# EasyEDA schematic SCH_IntegratedAvionics Mk. 1_2024-03-19.json

## Sheets
1 Sheet_1SEN: TITLE: Sheet_1; REV: 1.0; Date: 2023-04-23; Sheet: 1/2; Drawn By: Finn Wolff; Company: WOLFF INDUSTRIES
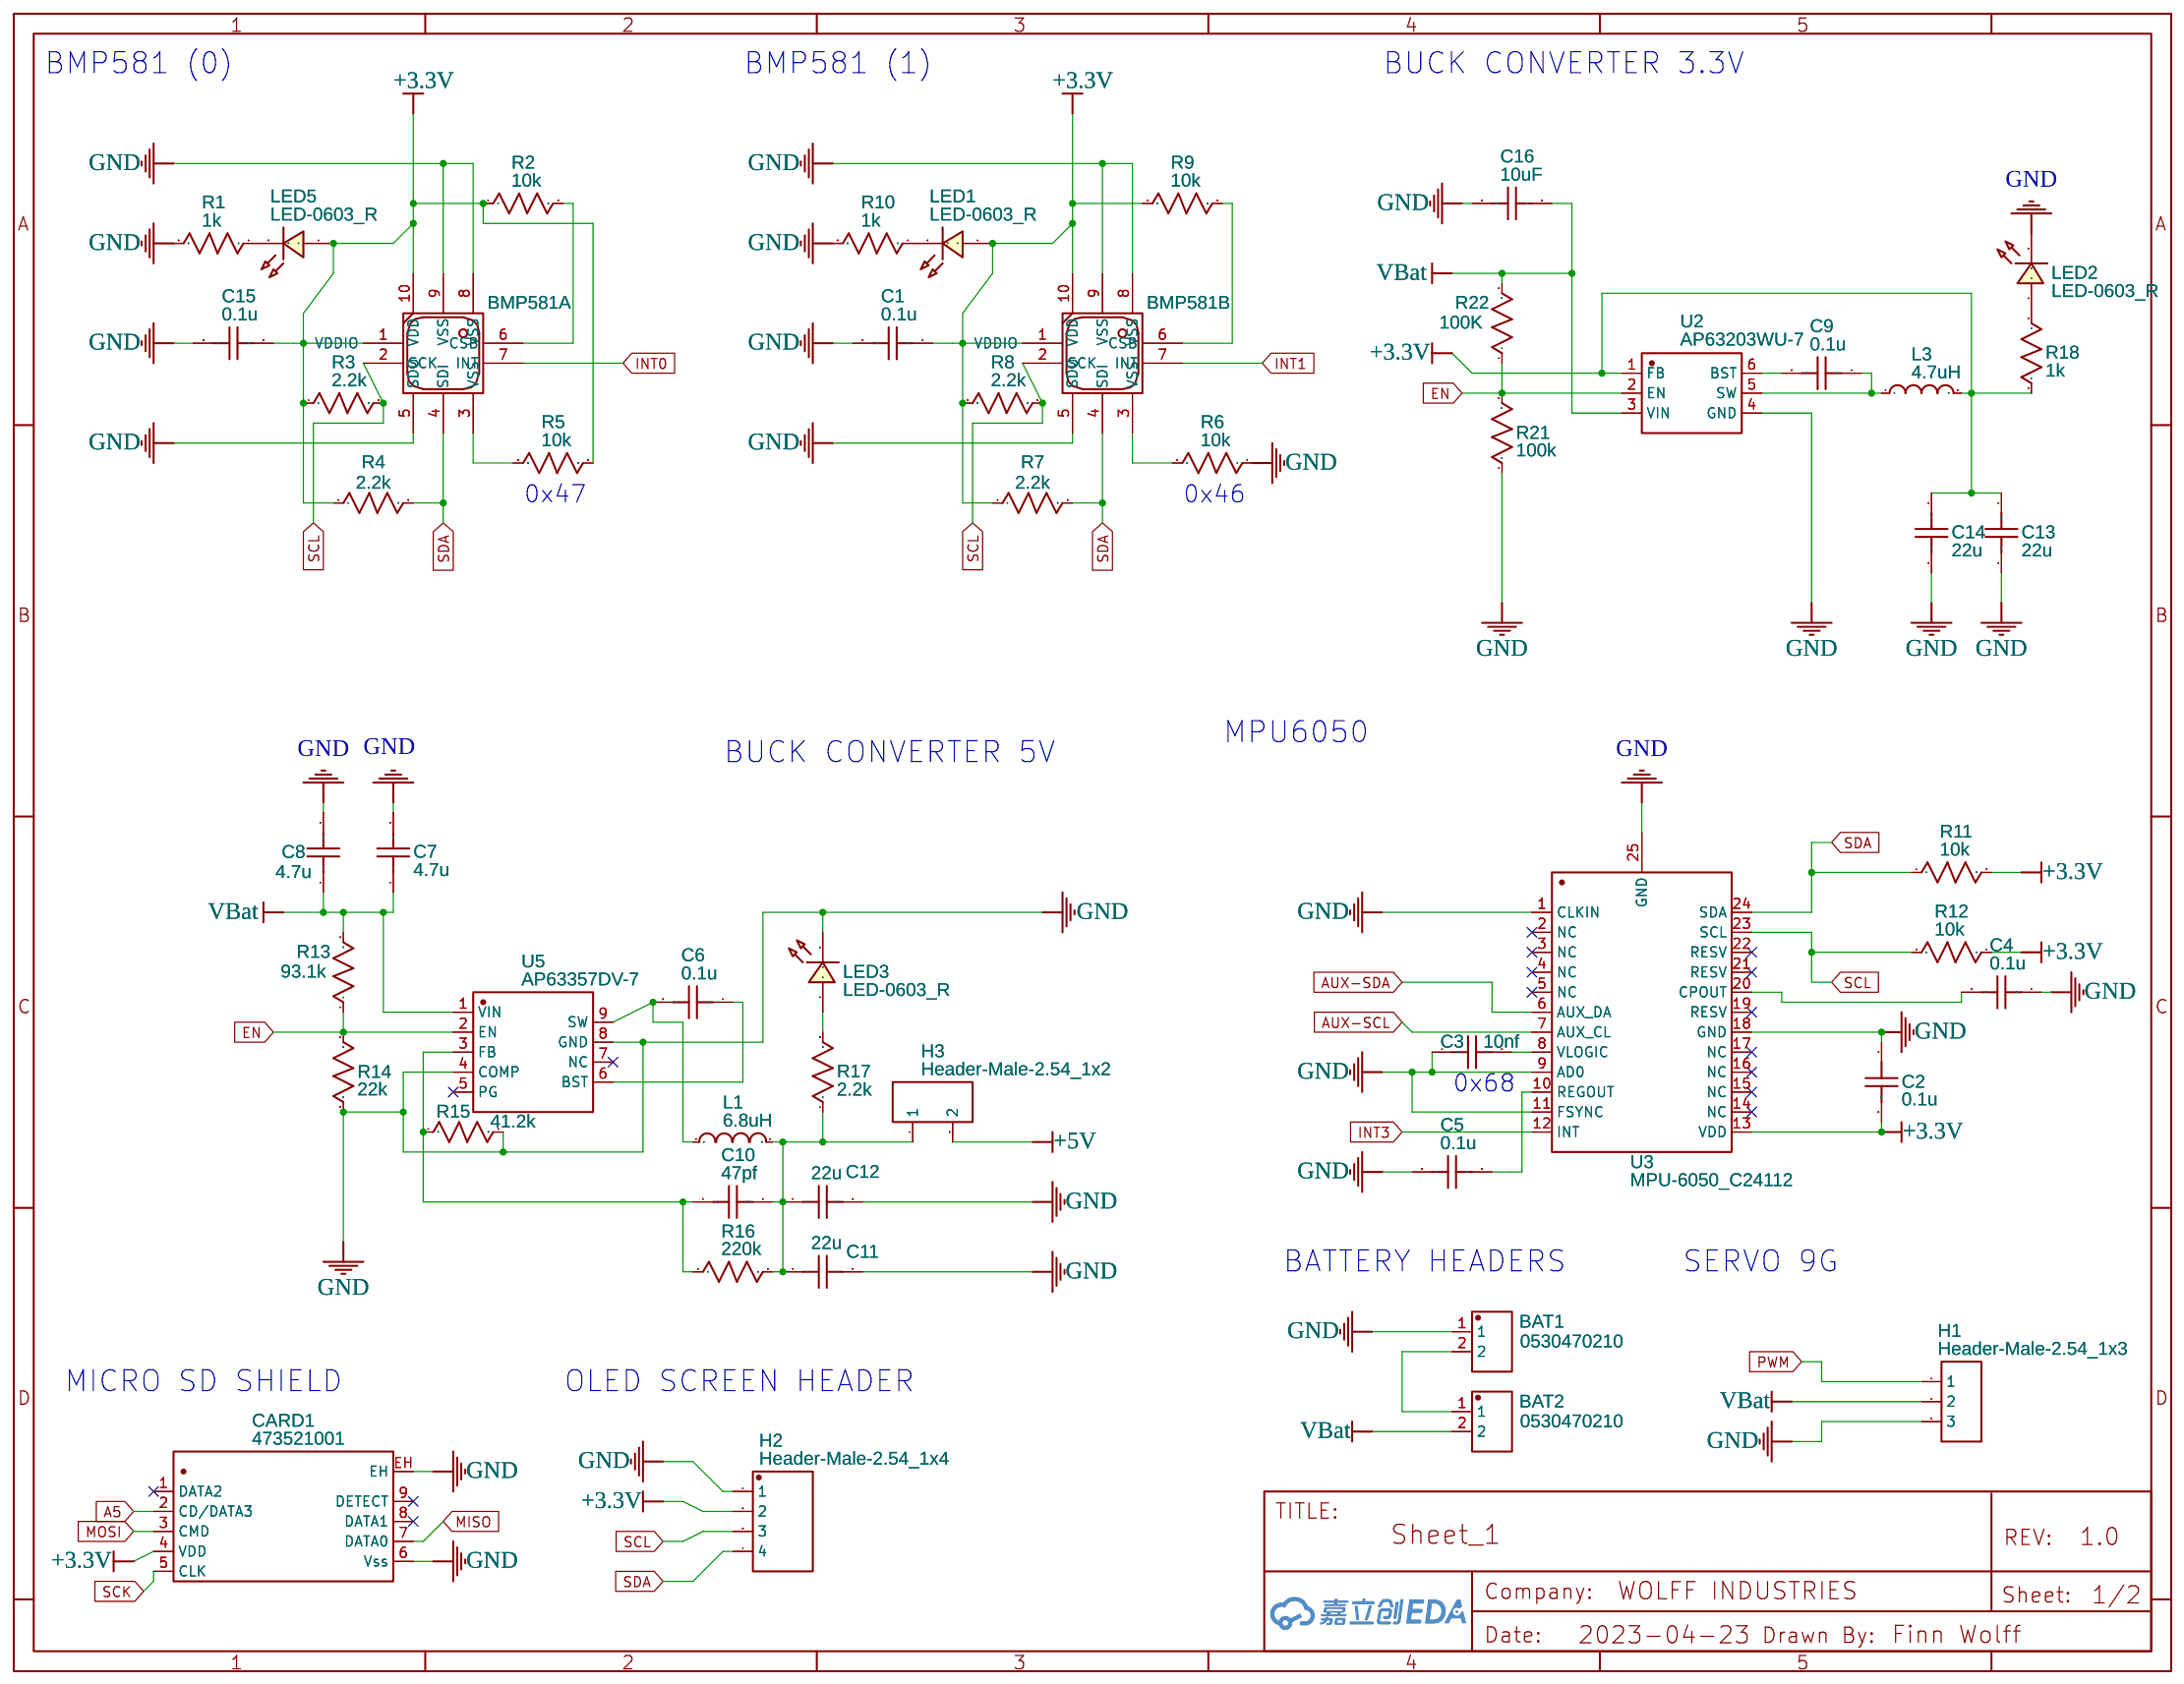
[diagram p0: Sheet_1SEN]
2 Sheet_2ESP: TITLE: Sheet_2; Date: 2023-05-04; Sheet: 2/2; Company: Your Company
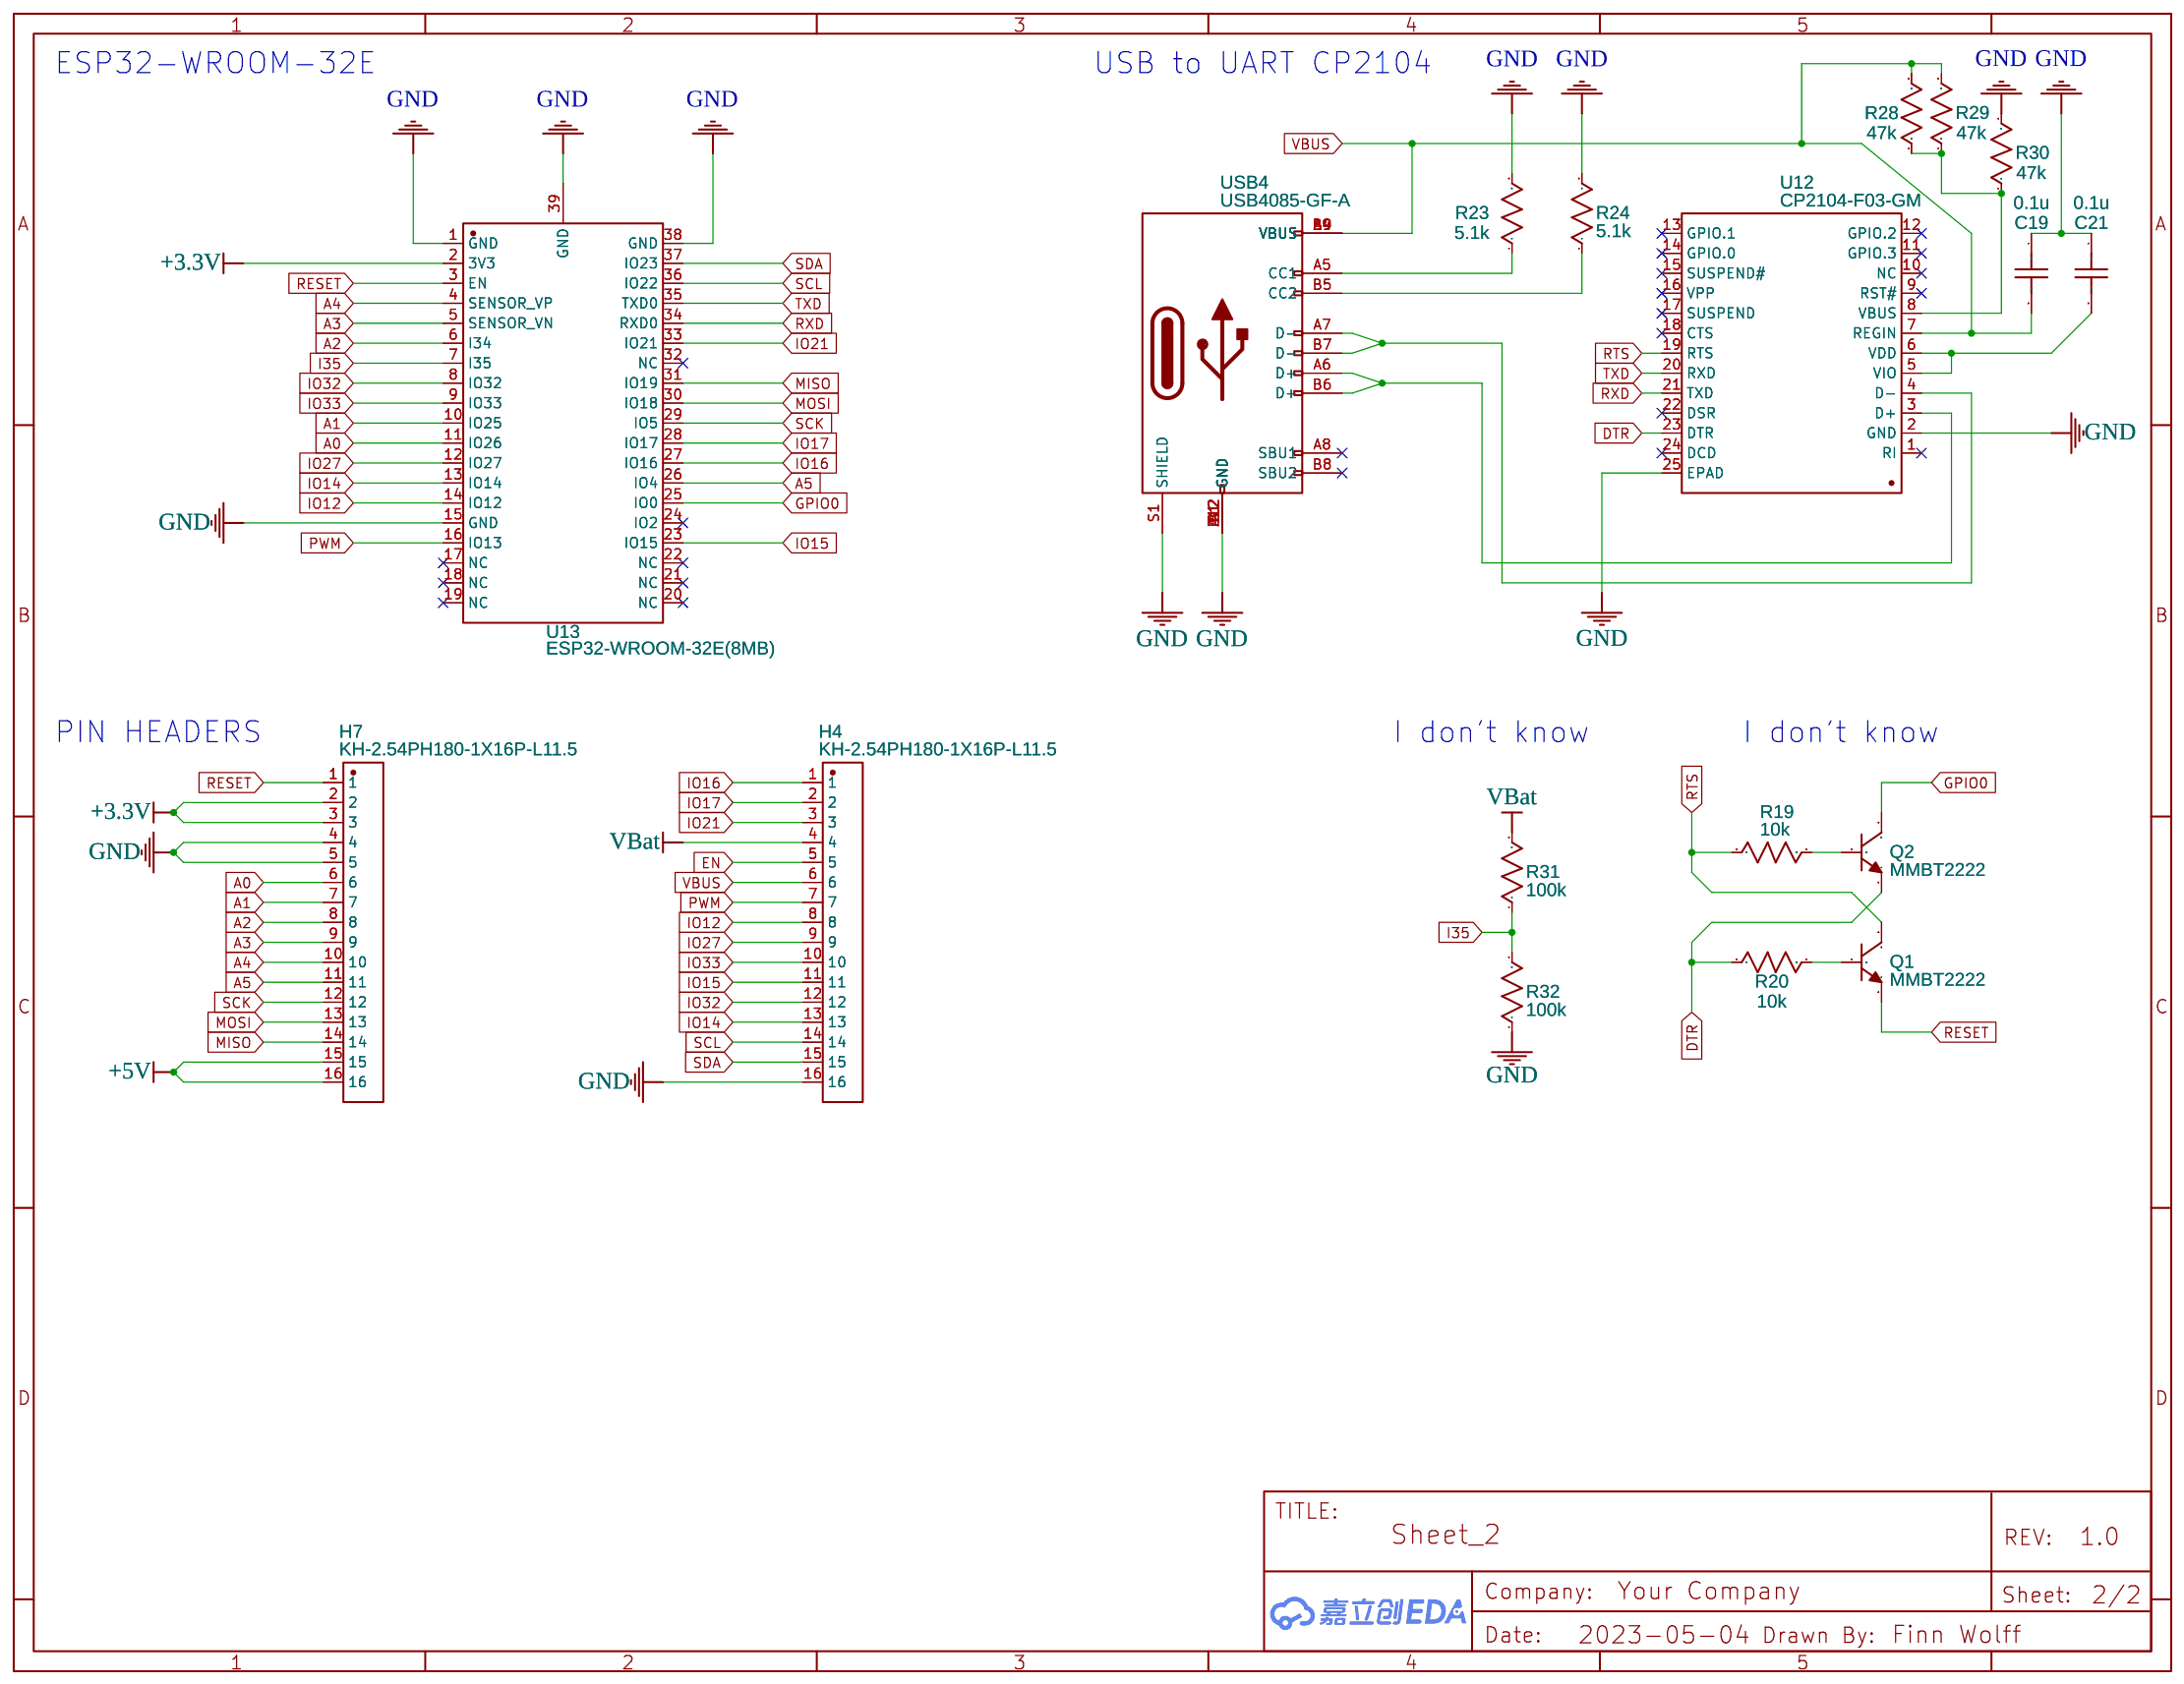
[diagram p1: Sheet_2ESP]

## Parts
sheet Sheet_1SEN
BAT1  0530470210  [CONN-TH_0530470210]
BAT2  0530470210  [CONN-TH_0530470210]
C1  0.1u  [C0402]
C2  0.1u  [C0402]
C3  10nf  [C0603]
C4  0.1u  [C0402]
C5  0.1u  [C0402]
C6  0.1u  [C0402]
C7  4.7u  [C0603]
C8  4.7u  [C0603]
C9  0.1u  [C0402]
C10  47pf  [C0603]
C11  22u  [C0603]
C12  22u  [C0603]
C13  22u  [C0603]
C14  22u  [C0603]
C15  0.1u  [C0402]
C16  10uF  [C1210]
CARD1  473521001  [SD-SMD_SD-47352-101]
H1  Header-Male-2.54_1x3  [HDR-TH_3P-P2.54-V-M-1]
H2  Header-Male-2.54_1x4  [HDR-TH_4P-P2.54-V-M]
H3  Header-Male-2.54_1x2  [HDR-TH_2P-P2.54-V-M-1]
L1  6.8uH  [IND-SMD_L5.0-W5.0_VLS5045EX-6R8M]
L3  4.7uH  [IND-SMD_L4.9-W4.9_NRS50XX]
LED1  LED-0603_R  [LED0603_RED]
LED2  LED-0603_R  [LED0603_RED]
LED3  LED-0603_R  [LED0603_RED]
LED5  LED-0603_R  [LED0603_RED]
R1  1k  [R0603]
R2  10k  [R0603]
R3  2.2k  [R0603]
R4  2.2k  [R0603]
R5  10k  [R0603]
R6  10k  [R0603]
R7  2.2k  [R0603]
R8  2.2k  [R0603]
R9  10k  [R0603]
R10  1k  [R0603]
R11  10k  [R0603]
R12  10k  [R0603]
R13  93.1k  [R0603]
R14  22k  [R0603]
R15  41.2k  [R0603]
R16  220k  [R0603]
R17  2.2k  [R0603]
R18  1k  [R0603]
R21  100k  [R0603]
R22  100K  [R0603]
U1  BMP581A  [BMP581]
U2  AP63203WU-7  [TSOT-26_L2.9-W1.6-P0.95-LS2.8-BL]
U3  MPU-6050_C24112  [QFN-24_L4.0-W4.0-P0.50-BL-EP2.7]
U4  BMP581B  [BMP581]
U5  AP63357DV-7  [V-DFN3020-13-A_L3.0-W2.0-P0.45-BL-EP_AP6335X]
sheet Sheet_2ESP
C19  0.1u  [C0603]
C21  0.1u  [C0603]
H4  KH-2.54PH180-1X16P-L11.5  [HDR-TH_16P-P2.54-V-M]
H7  KH-2.54PH180-1X16P-L11.5  [HDR-TH_16P-P2.54-V-M]
Q1  MMBT2222  [SOT-23-3_L2.9-W1.4-P1.91-LS2.6-BR]
Q2  MMBT2222  [SOT-23-3_L2.9-W1.4-P1.91-LS2.6-BR]
R19  10k  [R0603]
R20  10k  [R0603]
R23  5.1k  [R0603]
R24  5.1k  [R0603]
R28  47k  [R0603]
R29  47k  [R0603]
R30  47k  [R0603]
R31  100k  [R0603]
R32  100k  [R0603]
U12  CP2104-F03-GM  [QFN-24_L4.0-W4.0-P0.50-BL-EP2.7]
U13  ESP32-WROOM-32E(8MB)  [WIFI-SMD_ESP32-WROOM-32E]
USB4  USB4085-GF-A  [USC-C-SMD_USB4085-GF-A]

## Library data of the parts
BAT1 BAT2 = 0530470210: Supplier: LCSC; Manufacturer: MOLEX; Contributor: LCSC; Supplier Part: C114130; JLCPCB Part Class: Extended Part
C1 C2 C4-C6 C9 C15 = 0402B104K160CT: Contributor: LCSC; Supplier: LCSC; Supplier Part: C301929; Manufacturer: null; JLCPCB Part Class: Extended Part
C3 C7 C8 C10-C14 C19 C21 = C_0603_US: Contributor: LCEDA_Lib
C16 = CL32A106KA9LNNE: Contributor: LCSC; Supplier: LCSC; Supplier Part: C318783; Manufacturer: SAMSUNG(三星); JLCPCB Part Class: Extended Part
CARD1 = 473521001: Supplier: LCSC; Supplier Part: C293569; Manufacturer: MOLEX; Contributor: LCSC; JLCPCB Part Class: Extended Part
H1 = Header-Male-2.54_1x3: Supplier: LCSC; Manufacturer: BOOMELE(博穆精密); Manufacturer Part: 2.54-1*3P针; Supplier Part: C49257; JLCPCB Part Class: Extended Part
H2 = Header-Male-2.54_1x4: Supplier: LCSC; Manufacturer: Ckmtw(灿科盟); Manufacturer Part: B-2100S04P-A110; Contributor: LCSC; Supplier Part: C124378; JLCPCB Part Class: Extended Part
H3 = Header-Male-2.54_1x2: Supplier: LCSC; Manufacturer: TE Connectivity(美国泰科); Manufacturer Part: 826629-2; Supplier Part: C86471; JLCPCB Part Class: Extended Part
L1 = HPC5040NF-6R8M: Contributor: LCSC; Supplier: LCSC; Supplier Part: C357072; Manufacturer: TAI-TECH(台庆); JLCPCB Part Class: Extended Part
L3 = NRS5020T4R7MMGJ: Contributor: lcsc; Supplier: LCSC; Supplier Part: C92964; Manufacturer: TAIYO YUDEN(太诱); JLCPCB Part Class: Extended Part
LED1-LED3 LED5 = LED-0603_R: Manufacturer: EVERLIGHT(台湾亿光); Manufacturer Part: 19-217/R6C-AL1M2VY/3T; Supplier Part: C72044; Supplier: LCSC; Contributor: LCEDA_01
R1-R24 R28-R32 = R_0603_US: Contributor: LCEDA_Lib
U1 U4 = BMP581: Manufacturer: Bosch; Supplier: Digi-Key; Supplier Part: BMP581CT-ND; link: https://www.bosch-sensortec.com/products/environmental-sensors/pressure-sensors/bmp581/; Contributor: seradhe
U2 = AP63203WU-7: Contributor: LCSC; Supplier: LCSC; Supplier Part: C780769; Manufacturer: DIODES(美台); JLCPCB Part Class: Extended Part
U3 = MPU-6050_C24112: sourceId: 1T5FDZYC8; Supplier: LCSC; Manufacturer: TDK InvenSense(应美盛); Manufacturer Part: MPU-6050; Supplier Part: C24112; JLCPCB Part Class: Basic Part
U5 = AP63357DV-7: Supplier: LCSC; Supplier Part: C2158014; Manufacturer: DIODES(美台); Contributor: LCSC; JLCPCB Part Class: Extended Part
H4 H7 = KH-2.54PH180-1X16P-L11.5: Contributor: LCSC; Supplier: LCSC; Supplier Part: C2905491; Manufacturer: kinghelm(金航标); JLCPCB Part Class: Extended Part
Q1 Q2 = MMBT2222: Contributor: LCSC; Supplier: LCSC; Supplier Part: C2891810; Manufacturer: YONGYUTAI(永裕泰); JLCPCB Part Class: Extended Part
U12 = CP2104-F03-GM: Supplier: LCSC; Manufacturer: SILICON LABS(芯科); Manufacturer Part: CP2104-F03-GMR; Supplier Part: C47742; JLCPCB Part Class: Extended Part
U13 = ESP32-WROOM-32E(8MB): Supplier: LCSC; Supplier Part: C701342; Manufacturer: ESPRESSIF(乐鑫); Manufacturer Part: ESP32-WROOM-32E-N8; Contributor: LCSC; JLCPCB Part Class: Extended Part
USB4 = USB4085-GF-A: Supplier: LCSC; Supplier Part: C9900013983; Manufacturer: null; JLCPCB Part Class: Extended Part; Contributor: lcsc

## Nets
+3.3V: C1.1 C2.2 C13.1 C14.1 C15.1 CARD1.4(VDD) H2.2 H7.2 H7.3 L3.2 LED1.1 LED5.1 R2.1 R3.1 R4.1 R5.1 R7.1 R8.1 R9.1 R11.2 R12.1 R18.1 U1.10(VDD) U2.1(FB) U3.13(VDD) U4.10(VDD) U13.2(3V3)
+5V: H3.2 H7.15 H7.16
GND: BAT1.1 C1.2 C2.1 C3.1 C4.1 C5.2 C7.2 C8.2 C11.2 C12.2 C13.2 C14.2 C15.2 C16.2 C19.1 C21.1 CARD1.6(Vss) CARD1.EH H1.3 H2.1 H4.16 H7.4 H7.5 LED2.2 LED3.2 R1.2 R6.1 R10.2 R14.1 R15.2 R21.1 R23.2 R24.2 R30.2 R32.1 U1.5(SDO) U1.8(VSS) U1.9(VSS) U2.4(GND) U3.1(CLKIN) U3.9(AD0) U3.11(FSYNC) U3.18(GND) U3.25(GND) U4.5(SDO) U4.8(VSS) U4.9(VSS) U5.4(COMP) U5.8(GND) U12.2(GND) U12.25(EPAD) U13.1(GND) U13.15(GND) U13.38(GND) U13.39(GND) USB4.A1(GND) USB4.A12(GND) USB4.B1(GND) USB4.B12(GND) USB4.S1(SHIELD)
VBat: BAT2.2 C7.1 C8.1 C16.1 H1.2 H4.4 R13.2 R22.2 R31.2 U2.3(VIN) U5.1(VIN)
VBUS: C19.2 H4.6 R28.2 R29.2 U12.7(REGIN) USB4.A4(VBUS) USB4.A9(VBUS) USB4.B4(VBUS) USB4.B9(VBUS)
A0: H7.6 U13.11(IO26)
A1: H7.7 U13.10(IO25)
A2: H7.8 U13.6(I34)
A3: H7.9 U13.5(SENSOR_VN)
A4: H7.10 U13.4(SENSOR_VP)
A5: CARD1.2(CD/DATA3) H7.11 U13.26(IO4)
AUX-SCL: U3.7(AUX_CL)
AUX-SDA: U3.6(AUX_DA)
DTR: Q2.2(E) R20.1 U12.23(DTR)
EN: H4.5 R13.1 R14.2 R21.2 R22.1 U2.2(EN) U5.2(EN)
GPIO0: Q2.3(C) U13.25(IO0)
I35: R31.1 R32.2 U13.7(I35)
INT0: U1.7(INT)
INT1: U4.7(INT)
INT3: U3.12(INT)
IO12: H4.8 U13.14(IO12)
IO14: H4.13 U13.13(IO14)
IO15: H4.11 U13.23(IO15)
IO16: H4.1 U13.27(IO16)
IO17: H4.2 U13.28(IO17)
IO21: H4.3 U13.33(IO21)
IO27: H4.9 U13.12(IO27)
IO32: H4.12 U13.8(IO32)
IO33: H4.10 U13.9(IO33)
MISO: CARD1.7(DATA0) H7.14 U13.31(IO19)
MOSI: CARD1.3(CMD) H7.13 U13.30(IO18)
PWM: H1.1 H4.7 U13.16(IO13)
RESET: H7.1 Q1.2(E) U13.3(EN)
RTS: Q1.3(C) R19.1 U12.19(RTS)
RXD: U12.21(TXD) U13.34(RXD0)
SCK: CARD1.5(CLK) H7.12 U13.29(IO5)
SCL: H2.3 H4.14 R3.2 R8.2 R12.2 U1.2(SCK) U3.23(SCL) U4.2(SCK) U13.36(IO22)
SDA: H2.4 H4.15 R4.2 R7.2 R11.1 U1.4(SDI) U3.24(SDA) U4.4(SDI) U13.37(IO23)
TXD: U12.20(RXD) U13.35(TXD0)
Net-(BAT1-2): BAT1.2 BAT2.1
Net-(C3-2): C3.2 U3.8(VLOGIC)
Net-(C4-2): C4.2 U3.20(CPOUT)
Net-(C5-1): C5.1 U3.10(REGOUT)
Net-(C6-1): C6.1 U5.6(BST)
Net-(C6-2): C6.2 L1.1 U5.9(SW)
Net-(C9-1): C9.1 L3.1 U2.5(SW)
Net-(C9-2): C9.2 U2.6(BST)
Net-(C10-1): C10.1 R15.1 R16.1 U5.3(FB)
Net-(C10-2): C10.2 C11.1 C12.1 H3.1 L1.2 R16.2 R17.1
Net-(C21-2): C21.2 U12.5(VIO) U12.6(VDD)
Net-(LED1-2): LED1.2 R10.1
Net-(LED2-1): LED2.1 R18.2
Net-(LED3-1): LED3.1 R17.2
Net-(LED5-2): LED5.2 R1.1
Net-(Q1-1): Q1.1(B) R20.2
Net-(Q2-1): Q2.1(B) R19.2
Net-(R2-2): R2.2 U1.6(CSB)
Net-(R5-2): R5.2 U1.3(VSS)
Net-(R6-2): R6.2 U4.3(VSS)
Net-(R9-2): R9.2 U4.6(CSB)
Net-(R23-1): R23.1 USB4.A5(CC1)
Net-(R24-1): R24.1 USB4.B5(CC2)
Net-(R28-1): R28.1 R29.1 R30.1 U12.8(VBUS)
Net-(U12-3): U12.3(D+) USB4.A6(D+) USB4.B6(D+)
Net-(U12-4): U12.4(D-) USB4.A7(D-) USB4.B7(D-)

Not connected (* = marked no-connect by the designer): CARD1 1(DATA2)* 8(DATA1)* 9(DETECT)*; U1 1(VDDIO); U3 2(NC)* 3(NC)* 4(NC)* 5(NC)* 14(NC)* 15(NC)* 16(NC)* 17(NC)* 19(RESV)* 21(RESV)* 22(RESV)*; U4 1(VDDIO); U5 5(PG)* 7(NC)*; U12 1(RI)* 9(RST#)* 10(NC)* 11(GPIO.3)* 12(GPIO.2)* 13(GPIO.1)* 14(GPIO.0)* 15(SUSPEND#)* 16(VPP)* 17(SUSPEND)* 18(CTS)* 22(DSR)* 24(DCD)*; U13 17(NC)* 18(NC)* 19(NC)* 20(NC)* 21(NC)* 22(NC)* 24(IO2)* 32(NC)*; USB4 A8(SBU1)* B8(SBU2)*

## Notes on the sheets
sheet 1
- BMP581 (0)
- BMP581 (1)
- BUCK CONVERTER 3.3V
- 0x47
- 0x46
- MPU6050
- BUCK CONVERTER 5V
- 0x68
- BATTERY HEADERS
- SERVO 9G
- MICRO SD SHIELD
- OLED SCREEN HEADER
sheet 2
- ESP32-WROOM-32E
- USB to UART CP2104
- PIN HEADERS
- I don't know
- I don't know
